# EAGLE schematic chassis (EAGLE 6.6.0)
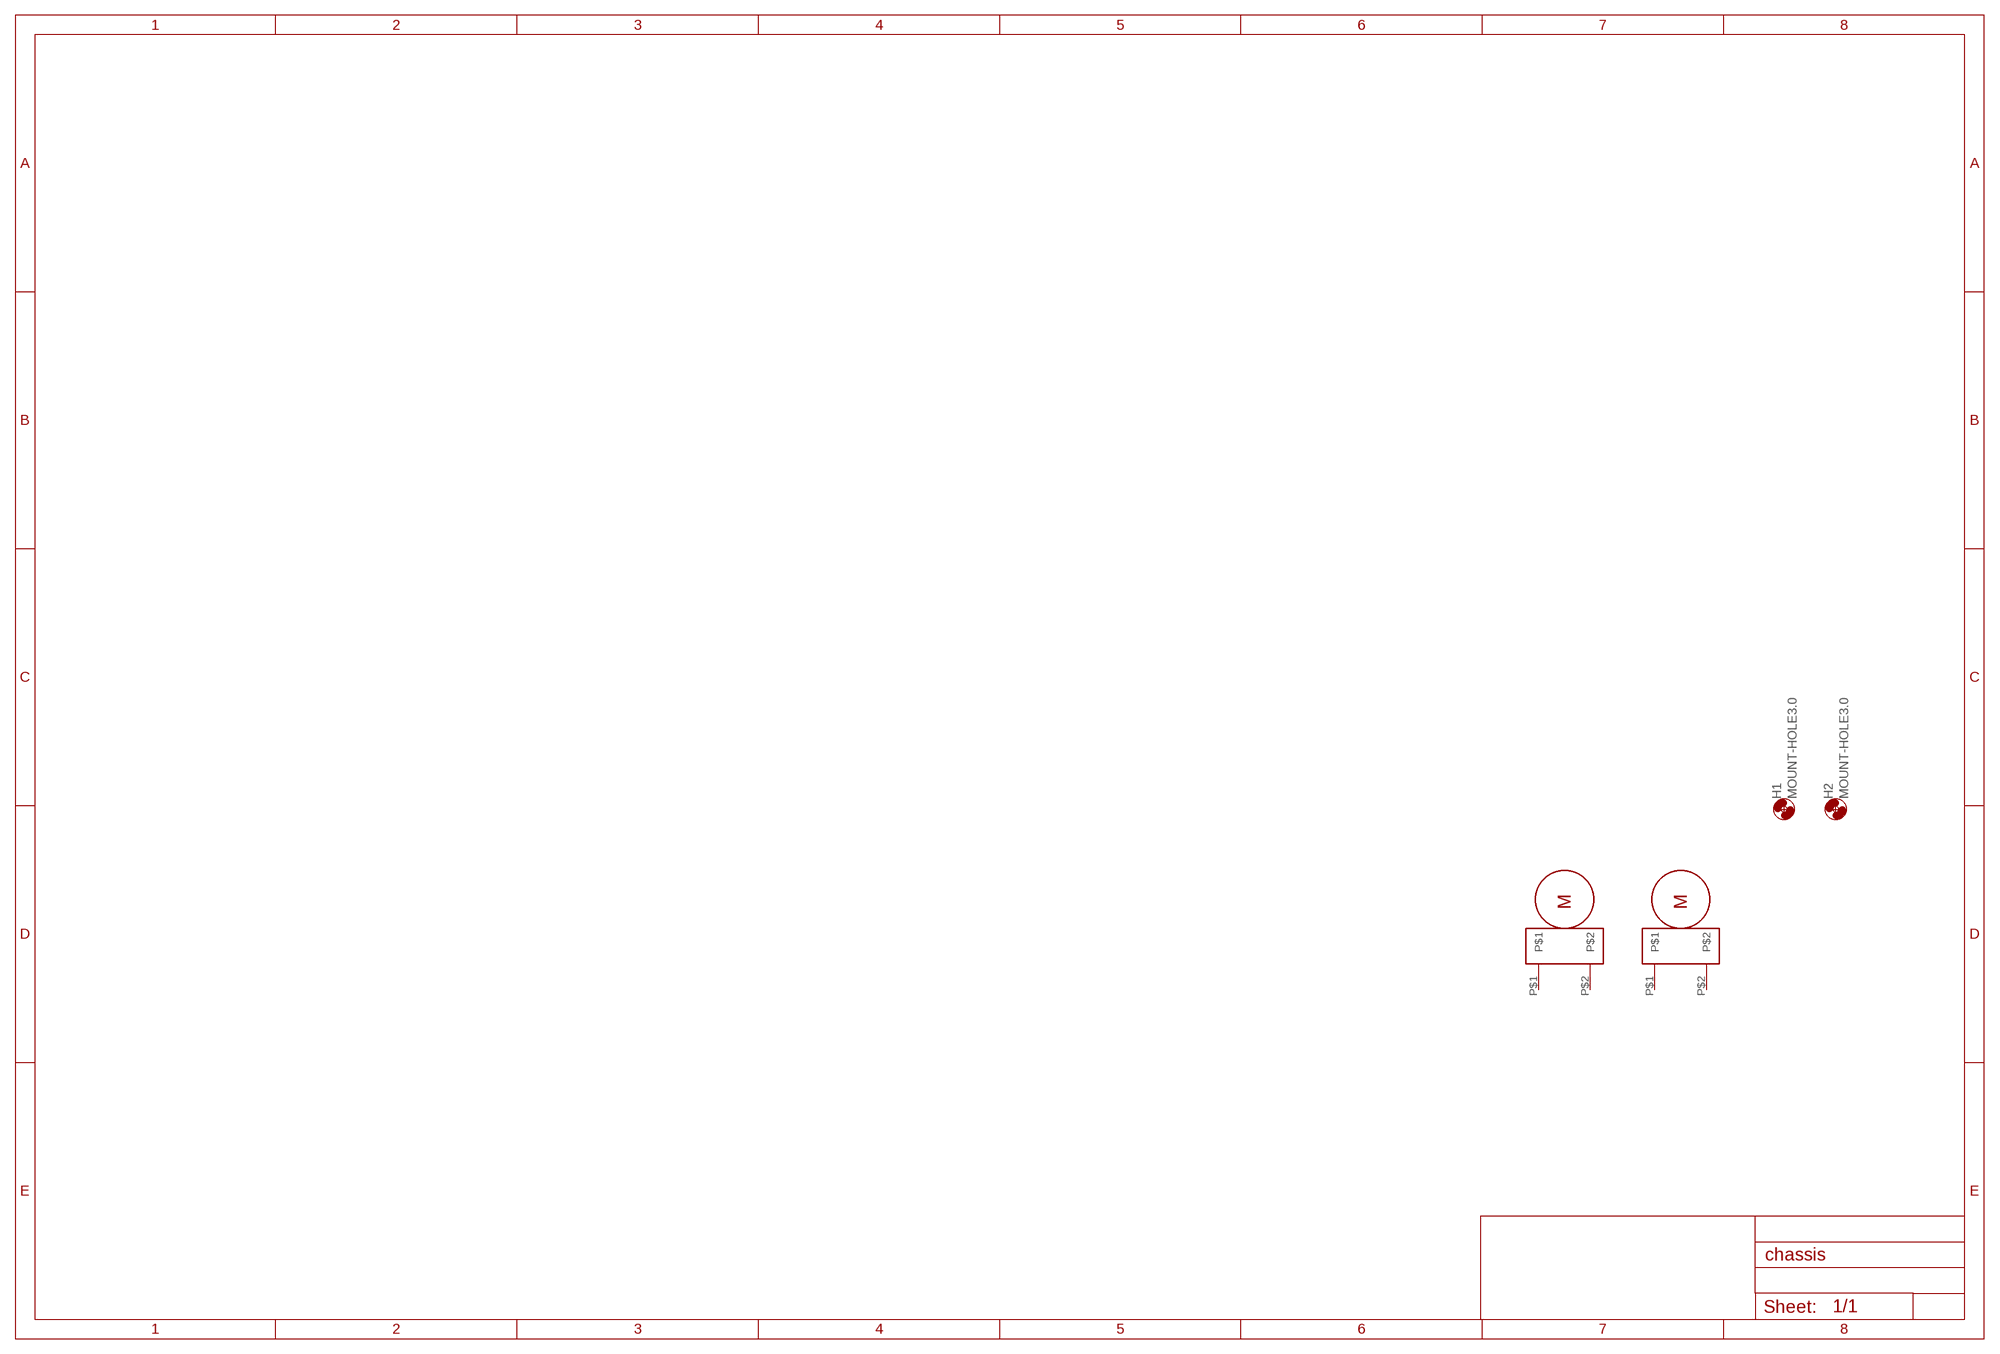
[diagram p0: schematic, sheet 1]

## Parts
H1  MOUNT-HOLE3.0  [3,0]
H2  MOUNT-HOLE3.0  [3,0]
U$8  PLANETARY_GEAR_MOTOR  [PLANETARY_GEAR_MOTOR]
U$9  PLANETARY_GEAR_MOTOR  [PLANETARY_GEAR_MOTOR]
Unconnected: U$8.P$1 U$8.P$2 U$9.P$1 U$9.P$2

## Library data of the parts
H1 H2 = holes:MOUNT-HOLE: MOUNTING HOLE with drill center marker
U$8 U$9 = my_parts:PLANETARY_GEAR_MOTOR